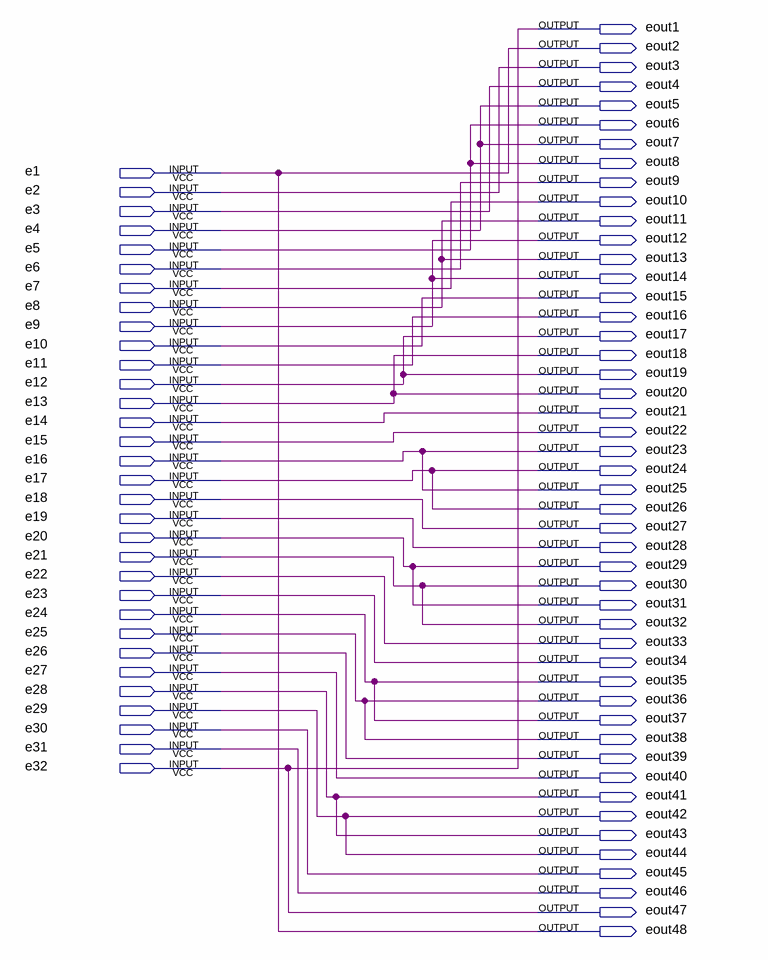
[diagram p0: schematic sheet]
// Quartus schematic Expension.bdf as structural Verilog: 0 symbols, 80 pins
module Expension (
  input  e1,
  input  e2,
  input  e3,
  input  e4,
  input  e5,
  input  e6,
  input  e7,
  input  e8,
  input  e9,
  input  e10,
  input  e11,
  input  e12,
  input  e13,
  input  e14,
  input  e15,
  input  e16,
  input  e17,
  input  e18,
  input  e19,
  input  e20,
  input  e21,
  input  e22,
  input  e23,
  input  e24,
  input  e25,
  input  e26,
  input  e27,
  input  e28,
  input  e29,
  input  e30,
  input  e31,
  input  e32,
  output eout1,
  output eout2,
  output eout3,
  output eout4,
  output eout5,
  output eout6,
  output eout7,
  output eout8,
  output eout9,
  output eout10,
  output eout11,
  output eout12,
  output eout13,
  output eout14,
  output eout15,
  output eout16,
  output eout17,
  output eout18,
  output eout19,
  output eout20,
  output eout21,
  output eout22,
  output eout23,
  output eout24,
  output eout25,
  output eout26,
  output eout27,
  output eout28,
  output eout29,
  output eout30,
  output eout31,
  output eout32,
  output eout33,
  output eout34,
  output eout35,
  output eout36,
  output eout37,
  output eout38,
  output eout39,
  output eout40,
  output eout41,
  output eout42,
  output eout43,
  output eout44,
  output eout45,
  output eout46,
  output eout47,
  output eout48
);


  assign eout1 = e32;
  assign eout2 = e1;
  assign eout3 = e2;
  assign eout4 = e3;
  assign eout5 = e4;
  assign eout6 = e5;
  assign eout7 = e4;
  assign eout8 = e5;
  assign eout9 = e6;
  assign eout10 = e7;
  assign eout11 = e8;
  assign eout12 = e9;
  assign eout13 = e8;
  assign eout14 = e9;
  assign eout15 = e10;
  assign eout16 = e11;
  assign eout17 = e12;
  assign eout18 = e13;
  assign eout19 = e12;
  assign eout20 = e13;
  assign eout21 = e14;
  assign eout22 = e15;
  assign eout23 = e16;
  assign eout24 = e17;
  assign eout25 = e16;
  assign eout26 = e17;
  assign eout27 = e18;
  assign eout28 = e19;
  assign eout29 = e20;
  assign eout30 = e21;
  assign eout31 = e20;
  assign eout32 = e21;
  assign eout33 = e22;
  assign eout34 = e23;
  assign eout35 = e24;
  assign eout36 = e25;
  assign eout37 = e24;
  assign eout38 = e25;
  assign eout39 = e26;
  assign eout40 = e27;
  assign eout41 = e28;
  assign eout42 = e29;
  assign eout43 = e28;
  assign eout44 = e29;
  assign eout45 = e30;
  assign eout46 = e31;
  assign eout47 = e32;
  assign eout48 = e1;
endmodule
